# Altium project OptySun.PrjPcb
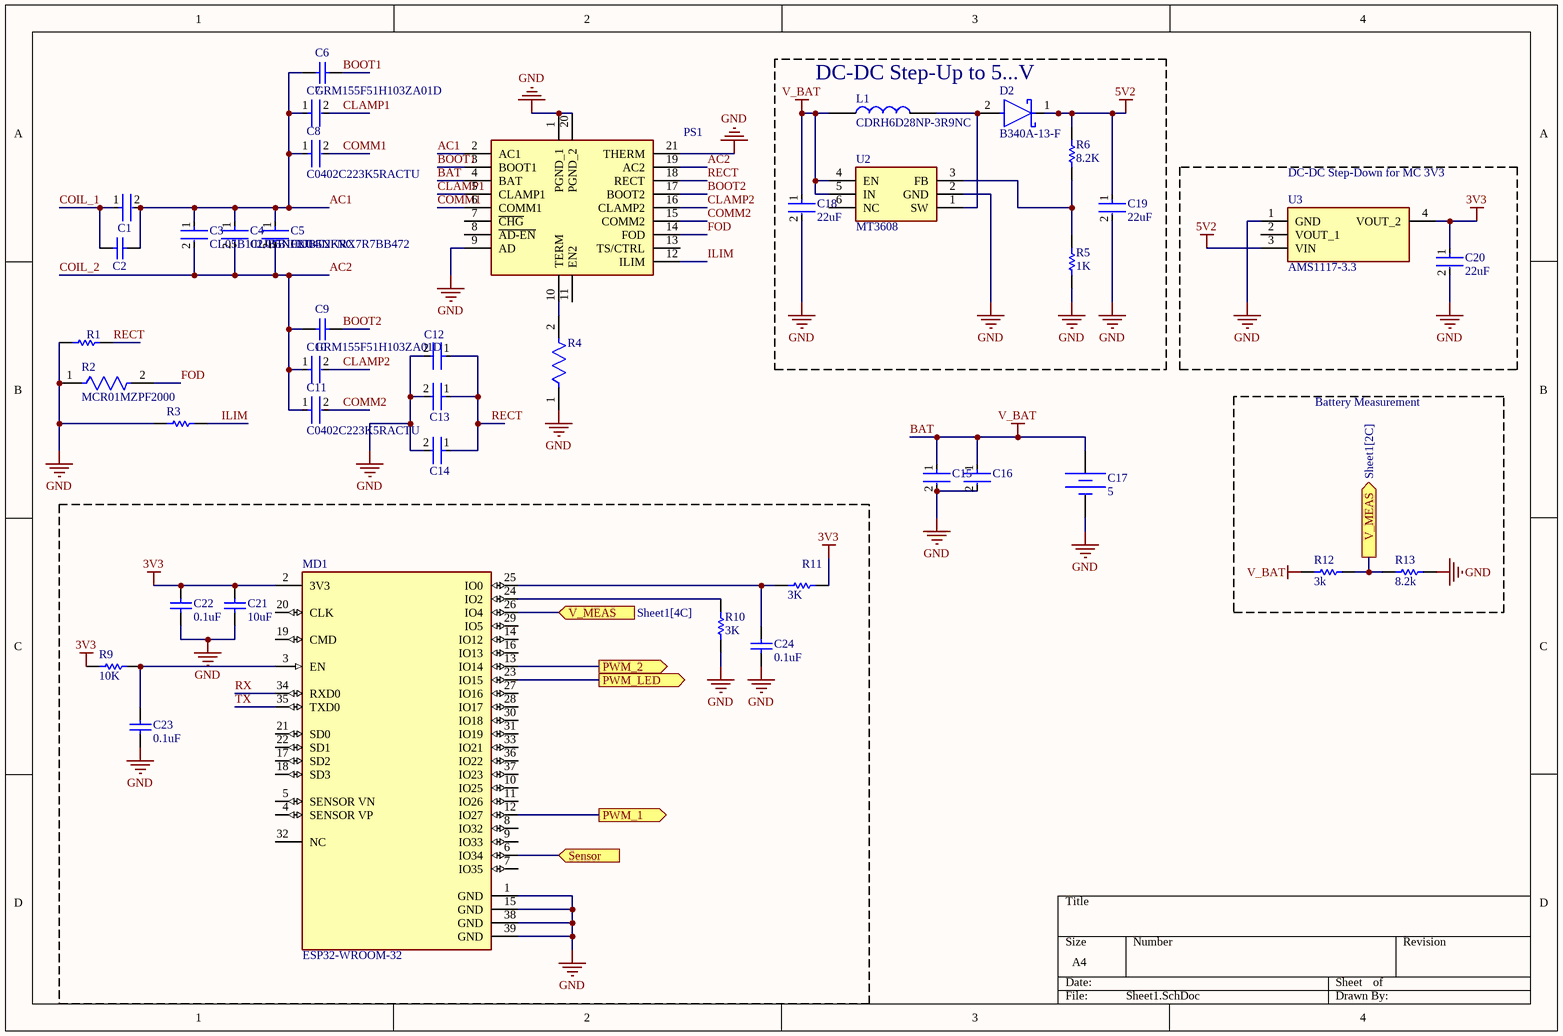
[diagram p0: Sheet1.SchDoc]
1 sheet, 41 parts. Net scope: flat (ports and power ports of the same name join across sheets).
Board file: PCB1.PcbDoc

## Sheet Sheet1.SchDoc
size A4; SheetNumber: 1; SheetTotal: 1

### Parts
C1  CL05A474KA5NNNC  [FP-CL545-IPC_C]  (value not drawn)
C2  04023D104KAT2A  [CAPC1005X56X25NL10T15]  (value not drawn)
C3  CL05B102JB5NFNC  [FP-CL956-IPC_C]
C4  CL05B102JB5NFNC  [FP-CL956-IPC_C]
C5  CC0402KRX7R7BB472  [FP-CC0402-MFG]
C6  GRM155F51H103ZA01D  [CAPC1005X55X25ML05T10]
C7  C1005X5R1E474K050BB  [FP-C1005-050-0_05-IPC_B]  (value not drawn)
C8  C0402C223K5RACTU  [FP-C0402-BB-MFG]
C9  GRM155F51H103ZA01D  [CAPC1005X55X25ML05T10]
C10  C1005X5R1E474K050BB  [FP-C1005-050-0_05-IPC_B]  (value not drawn)
C11  C0402C223K5RACTU  [FP-C0402-BB-MFG]
C12  CL10A106MA8NRNC  [FP-CL10-IPC_C]  (value not drawn)
C13  CL10A106MA8NRNC  [FP-CL10-IPC_C]  (value not drawn)
C14  C0603X5R1E104K030BB  [FP-C0603-030-0_03-IPC_C]  (value not drawn)
C15  EMK105BJ105KV-F  [FP-0402-L_1_0_0_05-W_0_5-IPC_A]  (value not drawn)
C16  GRM033R60J104KE19J  [FP-GRM033-0_03-MFG]  (value not drawn)
C17  DC Magnitude: 5  (hidden comment: Constant Voltage Source)
C18  22uF  [FP-GRM31C-0_2-e0_3_0_8-IPC_C]
C19  22uF  [FP-GRM31C-0_2-e0_3_0_8-IPC_C]
C20  22uF  [FP-GRM31C-0_2-e0_3_0_8-IPC_C]
C21  10uF  [CAPC1005X55X30LL05T10]
C22  0.1uF  [CAPC1005X55X30LL05T10]
C23  0.1uF  [CAPC1005X55X30LL05T10]
C24  0.1uF  [CAPC1005X55X30LL05T10]
D2  B340A-13-F  [FP-SMA-MFG]
L1  CDRH6D28NP-3R9NC  [INDPM6767X300N]
MD1  ESP32-WROOM-32  [FP-ESP32-WROOM-32-MFG]
PS1  BQ51050BRHLT  [RHL(R-PVQFN-N20)_1]  (value not drawn)
R1  ERJ-1GNF4122C  [RESC0603X26X15ML03T05]  (value not drawn)
R2  MCR01MZPF2000  [FP-MCR01-IPC_B]
R3  ERJ-1GEJ391C  [RESC0603X26X15NL03T05]  (value not drawn)
R4  RMCF0201JT2K40  [FP-RMCF0201-IPC_A]  (value not drawn)
R5  1K  [RESC1609X50X30NL8T20]
R6  8.2K  [RESC1609X50X30NL8T20]
R9  10K  [RESC1609X50X30NL8T20]
R10  3K  [RESC1609X50X30NL8T20]
R11  3K  [RESC1609X50X30NL8T20]
R12  3k  [RESC1609X50X30NL8T20]
R13  8.2k  [RESC1609X50X30NL8T20]
U2  MT3608  [SOT95P280X145-6N]  (net tie)
U3  AMS1117-3.3  [SOT229P700X180-4N]

### Blocks framed on the sheet
DC-DC Step-Up to 5...V: C18 C19 D2 L1 R5 R6 U2
DC-DC Step-Down for MC 3V3: C20 U3
Battery Measurement: R12 R13

### Ports
PWM_1 (out), PWM_2 (out), PWM_LED (out), Sensor (in), V_MEAS (in, see Sheet1[4C]), V_MEAS (out, see Sheet1[2C])

### Nets
3V3: C20.1 C21.2 C22.2 MD1.2(3V3) R9.1 R11.1 U3.4(VOUT_2)
5V2: C19.1 D2.1(C) R6.2 U3.3(VIN)
BAT: C15.1 C16.1 C17.1 C18.1 L1.1 PS1.4(BAT) R12.2 U2.4(EN) U2.5(IN)  [also labelled V_BAT]
GND: C12.2 C13.2 C14.2 C15.2 C16.2 C17.2 C18.2 C19.2 C20.2 C21.1 C22.1 C23.1 C24.1 MD1.1(GND) MD1.15(GND) MD1.38(GND) MD1.39(GND) PS1.1(PGND_1) PS1.9(AD) PS1.20(PGND_2) PS1.21(THERM) R1.1 R2.1 R3.1 R4.1 R5.1 R10.2 R13.1 U2.2(GND) U3.1(GND)
AC1: C1.2 C2.1 C3.1 C4.1 C5.1 C6.1 C7.1 C8.1 PS1.2(AC1)
AC2: C3.2 C4.2 C5.2 C9.1 C10.1 C11.1 PS1.19(AC2)  [also labelled COIL_2]
BOOT1: C6.2 PS1.3(BOOT1)
BOOT2: C9.2 PS1.17(BOOT2)
CLAMP1: C7.2 PS1.5(CLAMP1)
CLAMP2: C10.2 PS1.16(CLAMP2)
COIL_1: C1.1 C2.2
COMM1: C8.2 PS1.6(COMM1)
COMM2: C11.2 PS1.15(COMM2)
FOD: PS1.14(FOD) R2.2
ILIM: PS1.12(ILIM) R3.2
RECT: C12.1 C13.1 C14.1 PS1.18(RECT) R1.2
RX: MD1.34(RXD0)
TX: MD1.35(TXD0)
NetC23_2: C23.2 MD1.3(EN) R9.2
NetC24_2: C24.2 MD1.25(IO0) R11.2
NetD2_2: D2.2(A) L1.2 U2.1(SW)
NetMD1_6: MD1.6(IO34) ; port Sensor
NetMD1_12: MD1.12(IO27) ; port PWM_1
NetMD1_13: MD1.13(IO14) ; port PWM_2
NetMD1_23: MD1.23(IO15) ; port PWM_LED
NetMD1_24: MD1.24(IO2) R10.1
NetMD1_26: MD1.26(IO4) R12.1 R13.2 ; port V_MEAS
NetPS1_10: PS1.10(TERM) R4.2
NetR5_2: R5.2 R6.1 U2.3(FB)

Not connected (* = marked no-connect by the designer): MD1 4(SENSOR_VP) 5(SENSOR_VN) 7(IO35) 8(IO32) 9(IO33) 10(IO25) 11(IO26) 14(IO12) 16(IO13) 17(SD2) 18(SD3) 19(CMD) 20(CLK) 21(SD0) 22(SD1) 27(IO16) 28(IO17) 29(IO5) 30(IO18) 31(IO19) 32(NC) 33(IO21) 36(IO22) 37(IO23); PS1 7(~{CHG}) 8(~{AD-EN}) 11(EN2) 13(TS/CTRL); U2 6(NC); U3 2(VOUT_1)

### Library data of the parts
C1 = CMP-13271-002157-1: Cap Ceramic 470nF 25V X5R ±10% SMD 0402 +85°C Paper T/R; Voltage Rating: 25V; Voltage Rating (DC): 25V; Lead Free: Lead Free; Max Operating Temperature: 85°C; Case/Package: 0402; Width: 0.02inch; Thickness: 0.022inch; Case Code (Metric): 1005; Mount: Surface Mount; Min Operating Temperature: -55°C; Tolerance: 10%; Material: Ceramic; Length: 0.039inch; Case Code (Imperial): 0402; Package Quantity: 1; Capacitance: 470nF; Packaging: Tape and Reel
C2 = CMP-1034-02072-2: Manufacturer: AVX Interconnect / Elco; Part Number: 04023D104KAT2A
C3 C4 = CMP-13271-003618-1: Cap Ceramic 1nF 50V X7R ±5% SMD 0402 +125°C Paper T/R; Width: 0.02inch; Capacitance: 1nF; Length: 0.039inch; Packaging: Tape and Reel; Min Operating Temperature: -55°C; Case/Package: 0402; Package Quantity: 1; Mount: Surface Mount; Tolerance: 5%; Max Operating Temperature: 125°C; Voltage Rating: 50V; Case Code (Imperial): 0402; Thickness: 0.022inch; Case Code (Metric): 1005
C5 = CMP-1034-01810-2: CAP CER 4700PF 16V X7R 0402; Manufacturer: YAGEO; Automotive Grade: NA; Capacitance: 4.7 nF; Material: Ceramic; Value: 4.7 nF; Tolerance: 0.1; Temperature Coefficient: 30ppm/°C; Automotive: No; Temperature Range Low: -55°C; Category: Cap; RoHS: TRUE; Footprint Url: http://www.yageo.com/exep/pages/download/literatures/UPY-C_GEN_24.pdf; Device Class L2: Capacitors; Octopart: https://octopart.com/cc0402krx7r7bb472-yageo-44648962; Package: CC0402; Temperature Characteristic: X7R; ComponentLink2Description: Datasheet; ComponentLink2URL: http://www.yageo.com/documents/recent/UPY-GP_NP0_16V-to-50V_16.pdf; Mouser Description: YAGEO (PHYCOMP) - CC0402KRX7R7BB472 - CAP, MLCC, X7R, 4.7NF, 16V, 0402; Device Class L1: Passive Components; Ipc Land Pattern Name: CAPC10050X50; Height: 0.55mm; Voltage Rating: 16 V; Device Class L3: Ceramic Capacitors; Manufacturer Part Number: CC0402KRX7R7BB472; Temperature: -55°C to +125°C; Temperature Range High: +125°C; Lead Free: Yes; Digikey Description: CAP CER 4700PF 16V X7R 0402
C6 C9 = CMP-2008-04529-1: Manufacturer: Murata; Part Number: GRM155F51H103ZA01D
C7 C10 = CMP-2000-06003-2: Multilayer Ceramic Capacitors 470nF ±10% 25V X5R SMD 0402; Dissipation Factor: 10%; Case Code (Metric): 1005; RoHS Compliant: Yes; Lead Free: Lead Free; Length: 1mm; Case/Package: 0402; Termination: SMD/SMT; Voltage Rating: 25V; Dielectric Material: Ceramic; Dielectric: X5R; Depth: 0.5mm; Series: C; Voltage: 25V; Tolerance: 10%; Packaging: Tape and Reel; Capacitance: 470nF; Resistor Type: Ceramic; Min Operating Temperature: -55°C; Width: 0.02inch; Thickness: 500um; Package Quantity: 10000; Case Code (Imperial): 0402; Construction: Flat; Height: 0.5mm; REACH SVHC: No SVHC; Radiation Hardening: No; Weight: 2.3E-05oz; Mount: Surface Mount; Voltage Rating (DC): 25V; Max Operating Temperature: 85°C
C8 C11 = CMP-2008-03151-2: CAP CER 0.022UF 50V 10% X7R 0402; Manufacturer: Kemet; Tolerance: 0.1; Temperature Coefficient: 15%; Capacitance: 22,000 pF; Material: Ceramic; Value: 22,000 pF; Lead Free: Yes; ComponentLink2URL: https://content.kemet.com/datasheets/KEM_C1002_X7R_SMD.pdf; Category: Cap; Digikey Description: CAP CER 0.022UF 50V 10% X7R 0402; Manufacturer Part Number: C0402C223K5RACTU; Mouser Description: 0402 C 22nF Ceramic Multilayer Capacitor, 50 V, +125degC, X7R Dielectric, +/-10%; Temperature: -55°C to +125°C; Temperature Range High: +125°C; Device Class L3: Ceramic Capacitors; Device Class L1: Passive Components; Height: 0.55mm; Package: C0402-BB; Octopart: https://octopart.com/c0402c223k5ractu-kemet-99241; Temperature Range Low: -55°C; Voltage Rating: 50 V; Ipc Land Pattern Name: CAPC10050X50; ComponentLink2Description: Datasheet; Automotive: No; Temperature Characteristic: X7R; RoHS: TRUE; Device Class L2: Capacitors
C12 C13 = CMP-13271-004224-1: Cap Ceramic 10uF 25V X5R ±20% Pad SMD 0603 +85°C T/R; Width: 0.031inch; Voltage Rating: 25V; Length: 0.063inch; Case Code (Metric): 1608; Dielectric: X5R; Termination: Wraparound; Capacitance: 10uF; Lead Free: Lead Free; Mount: Surface Mount; Package Quantity: 1; Case Code (Imperial): 0603; Thickness: 0.035inch; Packaging: Tape and Reel; Contact Plating: Tin; Min Operating Temperature: -55°C; Tolerance: 20%; Max Operating Temperature: 85°C; Case/Package: 0603
C14 = CMP-08246-005139-1: Multilayer Ceramic Capacitors 100nF ±10% 25V X5R SMD 0201; Min Operating Temperature: -55°C; Tolerance: 10%; Height: 0.3mm; Capacitance: 100nF; Lead Free: Lead Free; Width: 0.012inch; Dielectric Material: Ceramic; Voltage Rating (DC): 25V; Voltage Rating: 25V; Thickness: 0.013inch; Depth: 0.3mm; Case Code (Imperial): 0201; Max Operating Temperature: 85°C; Case/Package: 0201; Series: C; RoHS Compliant: Yes; Packaging: Tape and Reel; Weight: 6E-06oz; Dielectric: X5R; Length: 0.6mm; Mount: Surface Mount; Case Code (Metric): 0603; Termination: SMD/SMT; REACH SVHC: No SVHC; Package Quantity: 15000
C15 = CMP-14477-000104-2: None; Tolerance: 10%; Voltage Rating: 16V; Dielectric: X5R; Capacitance: 1uF; Packaging: Tape and Reel; Depth: 0.5mm; Mount: Surface Mount; Thickness: 0.022inch; Package Quantity: 1; Min Operating Temperature: -55°C; Series: M; Voltage Rating (DC): 16V; Termination: SMD/SMT; Case/Package: 0402; Number of Pins: 2; Case Code (Imperial): 0402; Length: 1mm; Halogen Free: Halogen Free; Case Code (Metric): 1005; Width: 0.02inch; RoHS Compliant: Yes; Radiation Hardening: No; Max Operating Temperature: 85°C; Height: 0.5mm; Construction: Flat
C16 = CMP-2010-01258-2: Chip Multilayer Ceramic Capacitors for General Purpose, 0201, 0.10uF, X5R, 15%, 10%, 6.3V; Capacitance: 100nF; Voltage Rating: 6.3V; Package Quantity: 50000; Lead Free: Lead Free; Length: 0.6mm; Mount: Surface Mount; Termination: SMD/SMT; Dielectric: X5R; Packaging: Tape and Reel; Case/Package: 0201; Min Operating Temperature: -55°C; Voltage Rating (DC): 6.3V; Case Code (Metric): 0603; Max Operating Temperature: 85°C; Thickness: 0.013inch; Depth: 0.3mm; Radiation Hardening: No; Height: 0.3mm; Case Code (Imperial): 0201; Width: 0.012inch; Tolerance: 10%
C17 = Battery: SimulationGenericComponent: True
C18-C20 = CMP-06035-036836-1: Chip Multilayer Ceramic Capacitors for General Purpose, 1206, 22uF, X7R, 15%, 10%, 10V; Case Code (Metric): 3216; Min Operating Temperature: -55°C; Voltage Rating (DC): 10V; Case/Package: 1206; Width: 1.6mm; Thickness: 0.071inch; Length: 0.126inch; Termination: SMD/SMT; Mount: Surface Mount; Capacitance: 22uF; Height: 1.6mm; Voltage Rating: 10V; Packaging: Tape and Reel; Dielectric: X7R; Max Operating Temperature: 125°C; Package Quantity: 6000; Tolerance: 10%; Weight: 0.001411oz; Case Code (Imperial): 1206; Resistor Type: Ceramic
C21-C24 = CMP-0001-00074-2: Manufacturer: Kemet; Part Number: C0402C104K4RACTU
D2 = CMP-1667-00003-3: DIODE SCHOTTKY 40V 3A SMA; Max Forward Surge Current (Ifsm): 80A; Forward Voltage: 500mV; Polarity: Standard; Max Reverse Current: 500uA; Capacitance: 250pF; Element Configuration: Single; Mount: Surface Mount; Output Current: 3A; Radiation Hardening: No; Width: 2.92mm; Current Rating: 3A; Termination: SMD/SMT; Voltage: 40V; Series: -; Max Operating Temperature: 125°C; Current: 3A; Max Repetitive Reverse Voltage (Vrrm): 40V; Min Operating Temperature: -55°C; REACH SVHC: No SVHC; Number of Pins: 2; Average Rectified Current: 3A; Contact Plating: Tin; RoHS Compliant: Yes; Max Reverse Voltage (DC): 40V; Packaging: Tape and Reel; Height: 2.3mm; Length: 4.6mm; Case/Package: SMA; Weight: 0.002258oz; Peak Non-Repetitive Surge Current: 80A; Package Quantity: 5000; Lead Free: Lead Free; Forward Current: 3A; Voltage Rating (DC): 40V
L1 = CDRH6D28NP-3R9NC: Inductor Power Shielded Drum Core 3.9uH 30% 100KHz Ferrite 2.6A 27mOhm DCR T/R; Manufacturer_Name: Sumida; Geometry.Height: 3mm; Manufacturer_Part_Number: CDRH6D28NP-3R9NC; Mouser Part Number: 851-CDRH6D28NP-3R9NC; Mouser Price/Stock: https://www.mouser.co.uk/ProductDetail/Sumida/CDRH6D28NP-3R9NC?qs=zomZ4Ds8yq0PwwlLtueMZw%3D%3D; Arrow Part Number: CDRH6D28NP-3R9NC; Arrow Price/Stock: https://www.arrow.com/en/products/cdrh6d28np-3r9nc/sumida?region=nac; Datasheet Link: https://products.sumida.com/products/pdf/CDRH6D28.pdf
MD1 = CMP-194065-000008-1: RX TXRX MOD WIFI SURFACE MOUNT; Frequency: 2.5GHz; Sensitivity: -98dBm; Operating Supply Voltage: 3.6V; Data Rate: 150Mbps; Weight: 0.088185oz; Package Quantity: 550; Min Operating Temperature: -40°C; Mount: Surface Mount; Max Operating Temperature: 85°C; Packaging: Cut Tape; Case/Package: SMD/SMT
PS1 = BQ51050BRHLT: Power Supply; Manufacturer_Name: Texas Instruments; Datasheet Link: http://www.ti.com/lit/ds/symlink/bq51050b.pdf; Manufacturer_Part_Number: BQ51050BRHLT; Mouser Part Number: 595-BQ51050BRHLT; Mouser Price/Stock: https://www.mouser.co.uk/ProductDetail/Texas-Instruments/BQ51050BRHLT?qs=E2%2FxqS9xjzqwEGLvRoYWQw%3D%3D; Arrow Part Number: BQ51050BRHLT; Arrow Price/Stock: https://www.arrow.com/en/products/bq51050brhlt/texas-instruments?region=nac
R1 = CMP-2004-03348-1: Manufacturer: Panasonic; Part Number: ERJ-1GNF4122C
R2 = CMP-08839-015346-1: Thick Film Chip Resistor, 0402, 200Ω, 1%, 100ppm/°C, 0.063W, 50V; Resistance: 200R; Power Rating: 63mW; Depth: 0.5mm; Resistor Type: Thick Film; Military Standard: Not; Tolerance: 1%; Packaging: Tape and Reel; Temperature Coefficient: 100ppm/°C; Size Code: 0402; Case/Package: Molded; Construction: Rectangular; Voltage Rating (DC): 50V; RoHS Compliant: Yes; Max Operating Temperature: 155°C; Contact Plating: Tin; Mount: Surface Mount; Length: 1mm; Lead Free: Lead Free; Min Operating Temperature: -55°C
R3 = CMP-2004-03181-1: Manufacturer: Panasonic; Part Number: ERJ-1GEJ391C
R4 = CMP-26527-004736-1: 2.4kΩ ±5% 0.05W 0201 Thick Film Chip Resistor AEC-Q200 compliant; Max Power Dissipation: 50mW; Resistance: 2.4kR; Temperature Coefficient: 200ppm/°C; Resistor Type: Thick Film; Packaging: Tape and Reel; Number of Terminations: 2; Min Operating Temperature: -55°C; Tolerance: 5%; Radiation Hardening: No; Mount: Surface Mount; Case/Package: 0201; Contact Plating: Tin; Length: 0.024inch; Height: 0.009inch; Case Code (Imperial): 0201; RoHS Compliant: Yes; Width: 0.012inch; Case Code (Metric): 0603; Series: RMCF; Max Operating Temperature: 125°C
R5 R6 R9-R13 = CMP-2000-03816-5: Chip Resistor, 0 Ohm, Jumper, 100 mW, -55 to 155 degC, 0603 (1608 Metric), RoHS, Tape and Reel; Manufacturer: Vishay Semiconductor; Voltage Rating: 75 V; Package Quantity: 5000; DatasheetVersion: 06/2012; Min Operating Temperature: -55 degC; ComponentLink1URL: http://www.vishay.com/; Mounting Technology: Surface Mount; Height: 0.45 mm; ComponentLink1Description: Manufacturer URL; REACH SVHC: Unknown; PackageReference: 0603; Packaging: Tape and Reel; Max Operating Temperature: 155 degC; Mount: Surface Mount; ComponentLink2Description: Datasheet; PackageDescription: 2-Pin Surface Mount Device, Body 1.575 x 0.85 mm; Length: 1.55 mm; ComponentLink2URL: http://www.vishay.com/docs/20035/dcrcwe3.pdf; Pins: 2; RoHSCompliant: true
U2 = MT3608: High Efficiency 1.2MHz 2A Step Up Converter; Manufacturer_Name: Aerosemi; Geometry.Height: 1.45mm; Manufacturer_Part_Number: MT3608; Mouser Part Number: *; Mouser Price/Stock: *; Arrow Part Number: *; Arrow Price/Stock: *; Datasheet Link: https://www.olimex.com/Products/Breadboarding/BB-PWR-3608/resources/MT3608.pdf
U3 = AMS1117-3.3: 1A LOW DROPOUT VOLTAGE REGULATOR, SOT-223; Manufacturer_Name: Advanced Monolithic Systems; Geometry.Height: 1.8mm; Manufacturer_Part_Number: AMS1117-3.3; Mouser Part Number: *; Mouser Price/Stock: *; Arrow Part Number: *; Arrow Price/Stock: *; Datasheet Link: http://www.advanced-monolithic.com/pdf/ds1117.pdf